# EAGLE design BEP32 (EAGLE 6.5.0)
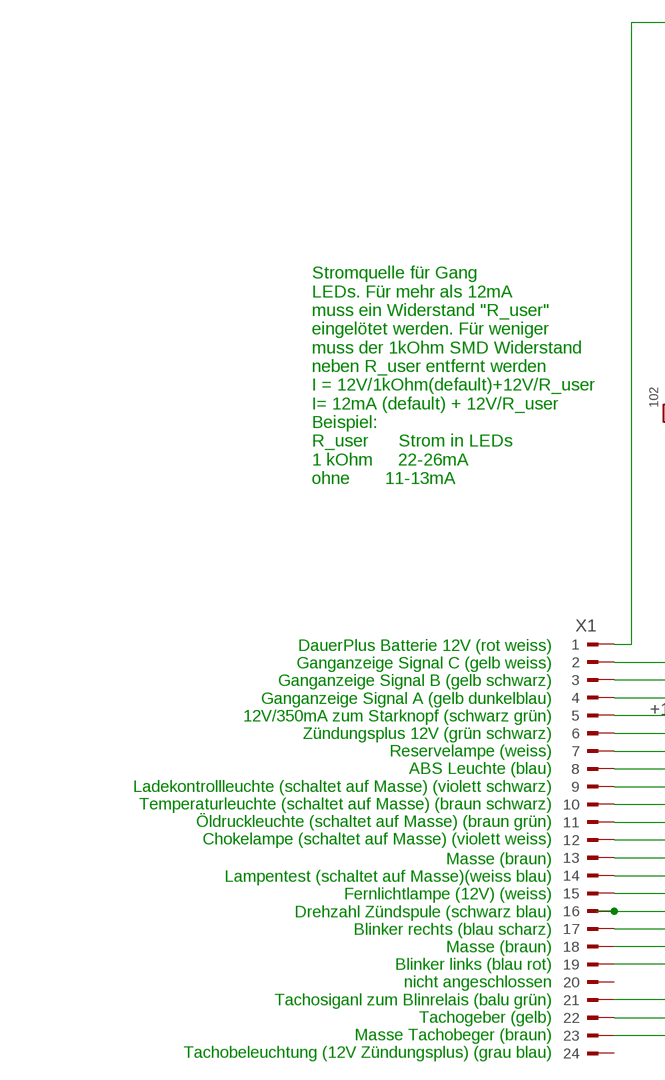
[diagram p0: schematic, sheet 1, part 1 of 2]
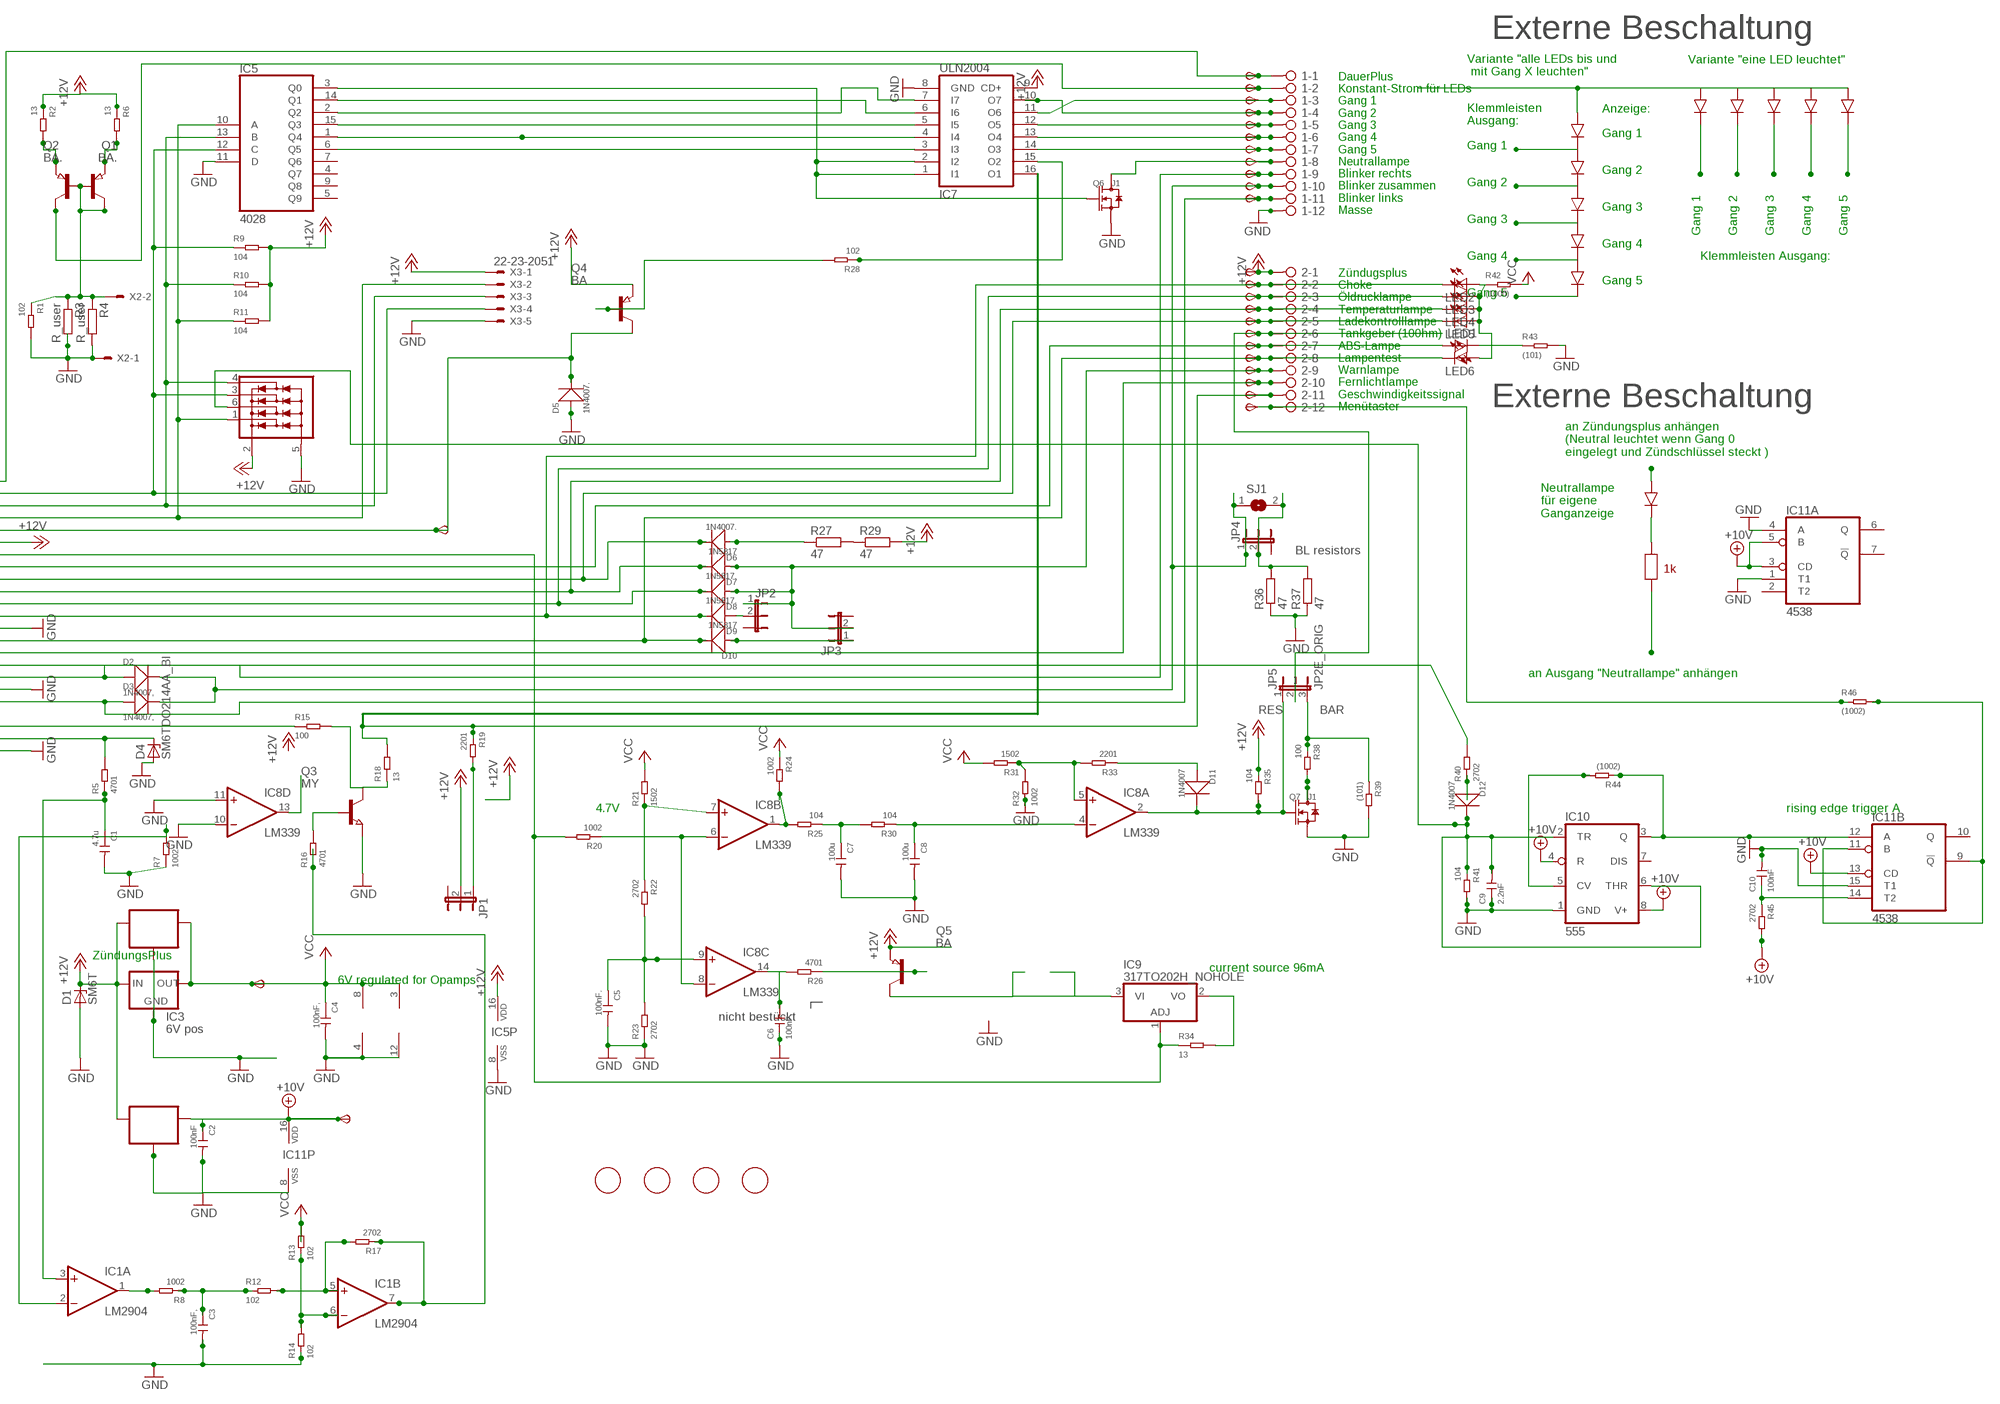
[diagram p1: schematic, sheet 1, part 2 of 2]

## Parts
1  2081-1132  [12-PIN]
2  2081-1132  [12-PIN]
6V  TPSB2.0  [B2.0]
10V  TPSB2.0  [B2.0]
C1  4.7u  CERAMIC-4.7UF-25V-10%-X5R(0805)  [C0805]
C2  100nF  CERAMIC-100NF-50V-10%-X7R(0805)  [C0805]
C3  100nF,  CERAMIC-100NF-50V-10%-X7R(0805)  [C0805]
C4  100nF,  CERAMIC-100NF-50V-10%-X7R(0805)  [C0805]
C5  100nF.  CERAMIC-100NF-50V-10%-X7R(0805)  [C0805]
C6  100nF.  CERAMIC-100NF-50V-10%-X7R(0805)  [C0805]
C7  100u  CERAMIC-100UF-6.3V-20%-X5R(1206)  [C1206]
C8  100u  CERAMIC-100UF-6.3V-20%-X5R(1206)  [C1206]
C9  2.2nF  CERAMIC-100NF-50V-10%-X7R(0805)  [C0805]
C10  100nF  CERAMIC-100NF-50V-10%-X7R(0805)  [C0805]
D1  SM6T  [DO214AA]
D2  1N4007,  DIODE-GEN-PURPOSE-1KV-1A(DO-214AC)  [DO-214AC]
D3  1N4007,  DIODE-GEN-PURPOSE-1KV-1A(DO-214AC)  [DO-214AC]
D4  SM6TDO214AA_BI  [DO214AA_BI]
D5  1N4007.  DIODE-GEN-PURPOSE-1KV-1A(DO-214AC)  [DO-214AC]
D6  1N4007.  DIODE-GEN-PURPOSE-1KV-1A(DO-214AC)  [DO-214AC]
D7  1N5817  DIODE-GEN-PURPOSE-1KV-1A(DO-214AC)DO-214AC/1206  [DO-214AC_SLIM]
D8  1N5817.  DIODE-GEN-PURPOSE-1KV-1A(DO-214AC)DO-214AC/1206  [DO-214AC_SLIM]
D9  1N5817.  DIODE-GEN-PURPOSE-1KV-1A(DO-214AC)DO-214AC/1206  [DO-214AC_SLIM]
D10  1N5817  DIODE-GEN-PURPOSE-1KV-1A(DO-214AC)DO-214AC/1206  [DO-214AC_SLIM]
D11  1N4007  DIODE-GEN-PURPOSE-1KV-1A(DO-214AC)  [DO-214AC]
D12  1N4007  DIODE-GEN-PURPOSE-1KV-1A(DO-214AC)  [DO-214AC]
FID1  FIDUCIAL  [FIDUCIAL_1MM]
FID2  FIDUCIAL  [FIDUCIAL_1MM]
FID3  FIDUCIAL  [FIDUCIAL_1MM]
FID4  FIDUCIAL  [FIDUCIAL_1MM]
IC1  LM2904  LM358D  [SO08]
IC2  78L06  78LXXSOT89_ROUND  [SOT89_ROUND]
IC3  6V pos  78LXX  [78LXX]
IC4  78L10  78LXXSOT89_ROUND  [SOT89_ROUND]
IC5  4028  4028D  [SO16]
IC6  NUP4304SOT457_R  [SOT457R_PHILIPS]
IC7  ULN2004  ULN2004AD  [SO16]
IC8  LM339  LM339D  [SO14]
IC9  317TO202H_NOHOLE  [TO220H_NOHOLE]
IC10  555  NE555D  [SO08]
IC11  4538  4538D  [SO16]
JP1  JP2EJP2_SMALLPADS  [JP2_SMALLPADS]
JP2  JP2EJP2_SMALLPADS  [JP2_SMALLPADS]
JP3  JP2EJP2_SMALLPADS  [JP2_SMALLPADS]
JP4  JP2EJP2_SMALLPADS  [JP2_SMALLPADS]
JP5  JP2E_ORIG  [JP2_ORIG_SMALLPADS]
LED1  LEDLD260  [LD260]
LED2  LEDLD260  [LD260]
LED3  LEDLD260  [LD260]
LED4  LEDLD260  [LD260]
LED5  LEDLD260  [LD260]
LED6  LEDLD260  [LD260]
Q1  BA.  PNP-TRANSISTOR_SOT89  [SOT89]
Q2  BA.  PNP-TRANSISTOR_SOT89  [SOT89]
Q3  MY  NPN-TRANSISTOR_SOT89  [SOT89]
Q4  BA  PNP-TRANSISTOR_SOT89  [SOT89]
Q5  BA  PNP-TRANSISTOR_SOT89  [SOT89]
Q6  J1  SMD-MOSFET-N-CH-50V-200MA-BSS138W-7-F(SOT-23)  [SOT-23]
Q7  J1  SMD-MOSFET-N-CH-50V-200MA-BSS138W-7-F(SOT-23)  [SOT-23]
R1  102  SMD-RES-1K-5%-1/8W(0805)  [R0805]
R2  13  SMD-RES-13R-5%-1/4W(1206)  [R1206]
R3  R_user  R-EU_R0805  [R0805]
R4  R_user  R-EU_R0805  [R0805]
R5  4701  SMD-RES-4.7K-5%-1/8W(0805)  [R0805]
R6  13  SMD-RES-13R-5%-1/4W(1206)  [R1206]
R7  1002  SMD-RES-10K-1%-1/8W(0805)  [R0805]
R8  1002  SMD-RES-10K-1%-1/8W(0805)  [R0805]
R9  104  SMD-RES-10K-1%-1/8W(0805)  [R0805]
R10  104  SMD-RES-10K-1%-1/8W(0805)  [R0805]
R11  104  SMD-RES-10K-1%-1/8W(0805)  [R0805]
R12  102  SMD-RES-1K-5%-1/8W(0805)  [R0805]
R13  102  SMD-RES-1K-5%-1/8W(0805)  [R0805]
R14  102  SMD-RES-1K-5%-1/8W(0805)  [R0805]
R15  100  SMD-RES-220R-5%-1/8W(0805)  [R0805]
R16  4701  SMD-RES-4.7K-5%-1/8W(0805)  [R0805]
R17  2702  SMD-RES-4.7K-5%-1/8W(0805)  [R0805]
R18  13  SMD-RES-13R-5%-1/4W(1206)  [R1206]
R19  2201  SMD-RES-2.2K-5%-1/8W(0805)  [R0805]
R20  1002  SMD-RES-10K-1%-1/8W(0805)  [R0805]
R21  1502  SMD-RES-10K-1%-1/8W(0805)  [R0805]
R22  2702  SMD-RES-4.7K-5%-1/8W(0805)  [R0805]
R23  2702  SMD-RES-4.7K-5%-1/8W(0805)  [R0805]
R24  1002  SMD-RES-10K-1%-1/8W(0805)  [R0805]
R25  104  SMD-RES-10K-1%-1/8W(0805)  [R0805]
R26  4701  SMD-RES-4.7K-5%-1/8W(0805)  [R0805]
R27  47  R-EU_V235/17_1MM  [V235/17_1MM]
R28  102  SMD-RES-1K-5%-1/8W(0805)  [R0805]
R29  47  R-EU_V235/17_1MM  [V235/17_1MM]
R30  104  SMD-RES-10K-1%-1/8W(0805)  [R0805]
R31  1502  SMD-RES-10K-1%-1/8W(0805)  [R0805]
R32  1002  SMD-RES-10K-1%-1/8W(0805)  [R0805]
R33  2201  SMD-RES-2.2K-5%-1/8W(0805)  [R0805]
R34  13  SMD-RES-13R-5%-1/4W(1206)  [R1206]
R35  104  SMD-RES-10K-1%-1/8W(0805)  [R0805]
R36  47  R-EU_V235/17_1MM  [V235/17_1MM]
R37  47  R-EU_V235/17_1MM  [V235/17_1MM]
R38  100  SMD-RES-2.2K-5%-1/8W(0805)  [R0805]
R39  (101)  SMD-RES-2.2K-5%-1/8W(0805)  [R0805]
R40  2702  SMD-RES-10K-1%-1/8W(0805)  [R0805]
R41  104  SMD-RES-10K-1%-1/8W(0805)  [R0805]
R42  (1000)  SMD-RES-100R-5%-1/8W(0805)  [R0805]
R43  (101)  SMD-RES-100R-5%-1/8W(0805)  [R0805]
R44  (1002)  SMD-RES-10K-1%-1/8W(0805)  [R0805]
R45  2702  SMD-RES-4.7K-5%-1/8W(0805)  [R0805]
R46  (1002)  SMD-RES-4.7K-5%-1/8W(0805)  [R0805]
SJ1  SJ  [SJ]
START  TPSB2.0  [B2.0]
TP1  TPSB2.0  [B2.0]
TP2  TPSB2.0  [B2.0]
TP3  TPSB2.0  [B2.0]
TP4  TPSB2.0  [B2.0]
TP5  TPSB2.0  [B2.0]
TP6  TPSB2.0  [B2.0]
TP7  TPSB2.0  [B2.0]
TP8  TPSB2.0  [B2.0]
TP9  TPSB2.0  [B2.0]
TP10  TPSB2.0  [B2.0]
TP11  TPSB2.0  [B2.0]
TP12  TPSB2.0  [B2.0]
TP13  TPSB2.0  [B2.0]
TP16  TPSB2.0  [B2.0]
TP17  TPSB2.0  [B2.0]
TP18  TPSB2.0  [B2.0]
TP19  TPSB2.0  [B2.0]
TP21  TPSB2.0  [B2.0]
TP22  TPSB2.0  [B2.0]
TP23  TPSB2.0  [B2.0]
TP24  TPSB1,27  [B1,27]
TP25  TPSB2.0  [B2.0]
TP26  TPSB2.0  [B2.0]
X1  CON_BMWV2  [24-PIN_V2]
X2  22-23-2021  [22-23-2021]
X3  22-23-2051  [22-23-2051]

## Nets
+10V: 10V.TP(PP) C2.1 IC4.1(OUT) IC10.4(R) IC10.8(V+) IC11.3(A:CD) IC11.5(A:B) IC11.13(B:CD) IC11.16(P:VDD) R45.2
+12V: 2.1 D1.C IC2.3(IN) IC3.IN IC4.3(IN) IC5.16(VDD) IC6.2(V+) IC7.9(CD+) JP1.2 Q4.3(E) Q5.3(E) R2.1 R6.1 R9.2 R10.2 R11.2 R29.2 R35.1 TP12.TP(PP) X1.6 X3.1
+12V1: IC1.7(B:OUT) R16.1 R17.1
GND: 1.12 C1.2 C2.2 C3.2 C4.2 C5.2 C6.1 C7.2 C8.2 C9.1 C10.2 D1.A D4.A D5.1(+) IC1.4(P:V-) IC2.2(GND) IC2.2@1(GND) IC3.GND IC4.2(GND) IC4.2@1(GND) IC5.8(VSS) IC5.11(D) IC6.5(V-) IC7.8(GND) IC8.10(D:-IN) IC8.11(D:+IN) IC8.12(P:GND) IC10.1(GND) IC11.1(A:T1) IC11.4(A:A) IC11.8(P:VSS) IC11.15(B:T1) Q3.3(E) Q6.2(S) Q7.2(S) R1.2 R3.2 R4.2 R7.1 R14.1 R23.1 R32.1 R36.1 R37.1 R39.2 R41.2 R43.2 X1.13 X1.18 X1.23 X2.1 X3.5
N$1: 2.9 D7.1(+) D8.1(+) JP2.1 JP3.2 TP24.TP(PP)
N$2: IC5.10(A) IC6.1(D1) R11.1 X1.4 X3.2
N$3: IC5.13(B) IC6.4(D4) R10.1 X1.3 X3.3
N$4: 2.7 LED1.A TP22.TP(PP) X1.8
N$5: Q1.3(E) R2.2
N$6: D11.2(-) IC8.2(A:OUT) JP5.1 Q7.1(G) R35.2
N$7: IC1.2(A:-IN) R7.2
N$8: R27.2 R29.1
N$9: Q2.3(E) R6.2
N$11: D5.2(-) Q4.2(C) START.TP(PP) X1.5
N$12: 2.2 D9.2(-) LED2.K(C) TP16.TP(PP) X1.12
N$13: 2.3 D8.2(-) LED3.K(C) TP17.TP(PP) X1.11
N$14: 2.4 D7.2(-) LED4.K(C) TP18.TP(PP) X1.10
N$15: IC9.3(VI) Q5.2(C)
N$16: IC8.6(B:-IN) IC8.8(C:-IN) R20.1
N$17: IC5.12(C) IC6.3(D3) R9.1 X1.2 X3.4
N$18: IC5.15(Q3) IC7.5(I5)
N$19: 2.8 D10.2(-) LED6.K(C) TP23.TP(PP) X1.14
N$20: 1.9 D2.1(+) TP9.TP(PP) X1.17
N$21: 1.11 D3.1(+) TP11.TP(PP) X1.19
N$22: IC11.9(B:!Q) IC11.11(B:B) R46.2
N$23: D4.C R5.2 X1.22
N$24: C1.1 IC1.3(A:+IN) R5.1
N$25: 1.6 IC7.13(O4) TP6.TP(PP)
N$26: 1.7 IC7.14(O3) TP7.TP(PP)
N$27: 2.11 IC7.16(O1) R18.2 R19.1 TP26.TP(PP)
N$28: 2.6 JP5.2 TP21.TP(PP)
N$29: JP1.1 R19.2
N$30: C5.1 IC8.9(C:+IN) R22.2 R23.2
N$31: C6.2 IC8.14(C:OUT) R26.2
N$32: C9.2 D12.2(-) IC6.6(D2) IC10.2(TR) IC10.6(THR) R41.1
N$34: LED1.K(C) R43.1
N$35: IC9.1(ADJ) R20.2 R34.1 X1.7
N$36: Q5.1(B) R26.1
N$37: IC5.2(Q2) IC7.7(I7)
N$38: 1.3 IC7.11(O6) TP3.TP(PP)
N$39: 1.5 IC7.12(O5) TP5.TP(PP)
N$41: LED2.A LED3.A LED4.A LED5.A LED6.A R42.1
N$42: R40.2 X1.16
N$43: Q4.1(B) R28.2
N$44: IC5.3(Q0) IC7.1(I1) IC7.2(I2) Q6.1(G)
N$45: C7.1 R25.1 R30.2
N$46: C8.1 IC8.4(A:-IN) R30.1
N$47: IC8.5(A:+IN) R31.1 R32.2 R33.2
N$48: Q7.3(D) R38.2
N$49: D11.1(+) R33.1
N$50: IC5.1(Q4) IC7.4(I4)
N$51: R15.1 X1.21
N$52: 1.8 Q6.3(D) TP8.TP(PP)
N$53: 2.10 TP25.TP(PP) X1.15
N$54: D6.1(+) R27.1
N$55: 2.5 D6.2(-) LED5.K(C) TP19.TP(PP) X1.9
N$56: IC5.14(Q1) IC7.6(I6)
N$57: Q1.1(B) Q2.1(B) Q2.2(C) R1.1 R3.1 R4.1 X2.2
N$58: Q3.2(C) R15.2 R18.1
N$59: 1.2 Q1.2(C) TP2.TP(PP)
N$60: IC8.13(D:OUT)
N$61: IC5.6(Q5) IC7.3(I3)
N$64: IC9.2(VO) R34.2
N$65: IC10.5(CV) R44.2
N$67: 1.4 IC7.10(O7) TP4.TP(PP)
N$69: 1.1 TP1.TP(PP) X1.1
N$83: IC8.7(B:+IN) R21.1 R22.1
N$85: Q3.1(B) R16.2
N$86: IC10.3(Q) IC11.12(B:A) R44.1
N$87: D12.1(+) R40.1
N$88: IC7.15(O2) R28.1
N$89: C10.1 IC11.14(B:T2) R45.1
N$90: 2.12 R46.1 TP13.TP(PP)
N$92: IC1.1(A:OUT) R8.2
N$93: 1.10 D2.2(-) D3.2(-) JP4.1 SJ1.1 TP10.TP(PP)
N$94: JP4.2 R36.2 R37.2 SJ1.2
N$95: D9.1(+) JP2.2
N$96: C3.1 R8.1 R12.1
N$97: IC1.5(B:+IN) R12.2 R17.2
N$98: D10.1(+) JP3.1
N$99: JP5.3 R38.1 R39.1
N$101: IC1.6(B:-IN) R13.1 R14.2
N$580: IC8.1(B:OUT) R24.2 R25.2
VCC: 6V.TP(PP) C4.1 IC1.8(P:V+) IC2.1(OUT) IC3.OUT IC8.3(P:V+) R13.2 R21.2 R24.1 R31.2 R42.2
Unconnected: IC5.4(Q7) IC5.5(Q9) IC5.7(Q6) IC5.9(Q8) IC10.7(DIS) IC11.2(A:T2) IC11.6(A:Q) IC11.7(A:!Q) IC11.10(B:Q) X1.20 X1.24

## Notes on the sheet
- Externe Beschaltung
- Variante "eine LED leuchtet"
- Variante "alle LEDs bis und
   mit Gang X leuchten"
- Anzeige:
- Klemmleisten
  Ausgang:
- Gang 1
- DauerPlus
  Konstant-Strom für LEDs
  Gang 1
  Gang 2
  Gang 3
  Gang 4
  Gang 5
  Neutrallampe
  Blinker rechts
  Blinker zusammen
  Blinker links
  Masse
- Gang 1
- Gang 2
- Gang 2
- Gang 3
- Gang 3
- Gang 1 | Gang 2 | Gang 3 | Gang 4 | Gang 5
- Gang 4
- Gang 4 | Klemmleisten Ausgang:
- Gang 5
- Gang 5
- Zündugsplus
  Choke
  Öldrucklampe
  Temperaturlampe
  Ladekontrolllampe
  Tankgeber (100hm)
  ABS-Lampe
  Lampentest
  Warnlampe
  Fernlichtlampe
  Geschwindigkeitssignal
  Menütaster
- Stromquelle für Gang
  LEDs. Für mehr als 12mA
  muss ein Widerstand "R_user"
  eingelötet werden. Für weniger
  muss der 1kOhm SMD Widerstand
  neben R_user entfernt werden
  I = 12V/1kOhm(default)+12V/R_user
  I= 12mA (default) + 12V/R_user
  Beispiel:
  R_user      Strom in LEDs
  1 kOhm     22-26mA
  ohne       11-13mA
- Externe Beschaltung
- an Zündungsplus anhängen
  (Neutral leuchtet wenn Gang 0
  eingelegt und Zündschlüssel steckt )
- Neutrallampe
  für eigene
  Ganganzeige
- DauerPlus Batterie 12V (rot weiss)
  Ganganzeige Signal C (gelb weiss)
  Ganganzeige Signal B (gelb schwarz)
  Ganganzeige Signal A (gelb dunkelblau)
  12V/350mA zum Starknopf (schwarz grün)
  Zündungsplus 12V (grün schwarz)
  Reservelampe (weiss)
  ABS Leuchte (blau)
  Ladekontrollleuchte (schaltet auf Masse) (violett schwarz)
  Temperaturleuchte (schaltet auf Masse) (braun schwarz)
  Öldruckleuchte (schaltet auf Masse) (braun grün)
  Chokelampe (schaltet auf Masse) (violett weiss)
- BL resistors
- 1k
- an Ausgang "Neutrallampe" anhängen
- Masse (braun)
  Lampentest (schaltet auf Masse)(weiss blau)
  Fernlichtlampe (12V) (weiss)
  Drehzahl Zündspule (schwarz blau)
  Blinker rechts (blau scharz)
  Masse (braun)
  Blinker links (blau rot)
  nicht angeschlossen
  Tachosiganl zum Blinrelais (balu grün)
  Tachogeber (gelb)
  Masse Tachobeger (braun)
  Tachobeleuchtung (12V Zündungsplus) (grau blau)
- RES | BAR
- 4.7V | rising edge trigger A
- ZündungsPlus
- current source 96mA
- 6V regulated for Opamps
- nicht bestückt

## Library data of the parts
1 2 = con WAGO BMW:2081-1132: WAGO SREW CLAMP
6V 10V START TP1-TP13 TP16-TP19 TP21-TP26 = testpin_BMW:TPS: TEST PIN
C1 = Seeed-Capacitor-2016:CERAMIC-4.7UF-25V-10%-X5R(0805): 302010146; MPN: CC0805KKX5R8BB475; VALUE: 4.7uf
C2-C6 C9 C10 = Seeed-Capacitor-2016:CERAMIC-100NF-50V-10%-X7R(0805): 302010165; MPN: CC0805KRX7R9BB104; VALUE: 100nf
C7 C8 = Seeed-Capacitor-2016:CERAMIC-100UF-6.3V-20%-X5R(1206): 302010183; MPN: GRM31CR60J107ME39L; VALUE: 100uf
D1 D4 = Suppressor_Diode_DO214AA:SM6T: Z DIODE
D2 D3 D5 D6 = Diode-do214ac:DIODE-GEN-PURPOSE-1KV-1A(DO-214AC): 304010013; MPN: 1N4007; VALUE: 1N4007
D7-D10 = Diode-do214ac:DIODE-GEN-PURPOSE-1KV-1A(DO-214AC): 304010013
D11 D12 = Diode-do214ac:DIODE-GEN-PURPOSE-1KV-1A(DO-214AC): 304010013; MPN: 1N4007
FID1-FID4 = Fiducial:FIDUCIAL: For use by pick and place machines to calibrate the vision/machine, 1mm By microbuilder.eu
IC1 = linear_BMW:LM358: OP AMP also LM158; LM258; LM2904 Source: http://cache.national.com/ds/LM/LM158.pdf
IC2 IC4 = 78LXX:78LXX
IC3 = v-reg:78LXX: VOLTAGE REGULATOR
IC5 = 4028:4028: BCD to decimal DECODER
IC6 = NUP4304_ESD_Diode_Array:NUP4304
IC7 = uln-udn:ULN2004A: DRIVER ARRAY
IC8 = LM339:LM339: Low Power Low Offset Voltage Quad Comparators with open collector; LM139/LM239/LM339/LM2901/LM3302
IC9 = linear_BMW:*317: Positive VOLTAGE REGULATOR
IC10 = linear:*555: TIMER
IC11 = 45xx:4538: Dual precision monostable MULTIVIBRATOR
JP1-JP4 = Switch Aliexpress 2:JP2E: JUMPER
JP5 = Switch Aliexpress 2:JP2E_ORIG
LED1-LED6 = led:LED: LED OSRAM: - CHIPLED LG R971, LG N971, LY N971, LG Q971, LY Q971, LO R971, LY R971 LH N974, LH R974 LS Q976, LO Q976, LY Q976 LO Q996 - Hyper CHIPLED LW Q18S LB Q993, LB Q99A, LB R99A - SideLED LS A670, LO A670, LY A670, LG A670, LP A670 LB A673, LV A673, LT A673, LW A673 LH A674 LY A675 LS A676, LA A676, LO A676, LY A676, LW A676 LS A679, LY A679, LG A679 - Hyper Micro SIDELED® LS Y876, LA Y876, LO Y876, LY Y876 LT Y87S - SmartLED LW L88C, LW L88S LB L89C, LB L89S, LG L890 LS L89K, LO L89K, LY L89K LS L896, LA L896, LO L896, LY L896 - TOPLED LS T670, LO T670, LY T670, LG T670, LP T670 LSG T670, LSP T670, LSY T670, LOP T670, LYG T670 LG T671, LOG T671, LSG T671 LB T673, LV T673, LT T673, LW T673 LH T674 LS T676, LA T676, LO T676, LY T676, LB T676, LH T676, LSB T676, LW T676 LB T67C, LV T67C, LT T67C, LS T67K, LO T67K, LY T67K, LW E67C LS E67B, LA E67B, LO E67B, LY E67B, LB E67C, LV E67C, LT E67C LW T67C LS T679, LY T679, LG T679 LS T770, LO T770, LY T770, LG T770, LP T770 LB T773, LV T773, LT T773, LW T773 LH T774 LS E675, LA E675, LY E675, LS T675 LS T776, LA T776, LO T776, LY T776, LB T776 LHGB T686 LT T68C, LB T68C - Hyper Mini TOPLED® LB M676 - Mini TOPLED Santana® LG M470 LS M47K, LO M47K, LY M47K Source: http://www.osram.convergy.de LUXEON: - LUMILED® LXK2-PW12-R00, LXK2-PW12-S00, LXK2-PW14-U00, LXK2-PW14-V00 LXK2-PM12-R00, LXK2-PM12-S00, LXK2-PM14-U00 LXK2-PE12-Q00, LXK2-PE12-R00, LXK2-PE12-S00, LXK2-PE14-T00, LXK2-PE14-U00 LXK2-PB12-K00, LXK2-PB12-L00, LXK2-PB12-M00, LXK2-PB14-N00, LXK2-PB14-P00, LXK2-PB14-Q00 LXK2-PR12-L00, LXK2-PR12-M00, LXK2-PR14-Q00, LXK2-PR14-R00 LXK2-PD12-Q00, LXK2-PD12-R00, LXK2-PD12-S00 LXK2-PH12-R00, LXK2-PH12-S00 LXK2-PL12-P00, LXK2-PL12-Q00, LXK2-PL12-R00 Source: www.luxeon.com KINGBRIGHT: KA-3528ASYC Source: www.kingbright.com
Q1 Q2 Q4 Q5 = Transistor_SOT89:PNP-TRANSISTOR_: PNP TRANSISTOR
Q3 = Transistor_SOT89:NPN-TRANSISTOR_: NPN TRANSISTOR
Q6 Q7 = Seeed-Transistor-2016:SMD-MOSFET-N-CH-50V-200MA-BSS138W-7-F(SOT-23): 305030000; MPN: BSS138W-7-F; VALUE: BSS138W-7-F
R1 R12-R14 R28 = Seeed-Resistor-2016:SMD-RES-1K-5%-1/8W(0805): 301010311; MPN: RC0805JR-071KL; VALUE: 1K
R2 R6 R18 R34 = Seeed-Resistor-2016:SMD-RES-13R-5%-1/4W(1206): 301010405; MPN: RC1206JR-0713RL; VALUE: 13R
R3 R4 R27 R29 R36 R37 = rcl:R-EU_: RESISTOR, European symbol
R5 R16 R17 R22 R23 R26 R45 R46 = Seeed-Resistor-2016:SMD-RES-4.7K-5%-1/8W(0805): 301010306; MPN: RC0805JR-074K7L; VALUE: 4.7K
R7-R11 R20 R21 R24 R25 R30-R32 R35 R40 R41 R44 = Seeed-Resistor-2016:SMD-RES-10K-1%-1/8W(0805): 301010361; MPN: RC0805FR-0710KL; VALUE: 10K
R15 = Seeed-Resistor-2016:SMD-RES-220R-5%-1/8W(0805): 301010315; MPN: RC0805JR-07220RL; VALUE: 220R
R19 R33 R38 R39 = Seeed-Resistor-2016:SMD-RES-2.2K-5%-1/8W(0805): 301010333; MPN: RC0805JR-072K2L; VALUE: 2.2K
R42 R43 = Seeed-Resistor-2016:SMD-RES-100R-5%-1/8W(0805): 301010319; MPN: RC0805JR-07100RL; VALUE: 100R
SJ1 = solder-jumper:SJ: SMD solder JUMPER
X1 = con_BMW:CON_BMW: BMW CONNECTOR
X2 = con_Molex_BMW:22-23-2021: .100" (2.54mm) Center Header - 2 Pin; MF: MOLEX; MPN: 22-23-2021; OC_FARNELL: 1462926; OC_NEWARK: 25C3832
X3 = con_Molex_BMW:22-23-2051: .100" (2.54mm) Center Header - 5 Pin; MF: MOLEX; MPN: 22-23-2051; OC_FARNELL: 1462952; OC_NEWARK: 38C9178

## Board
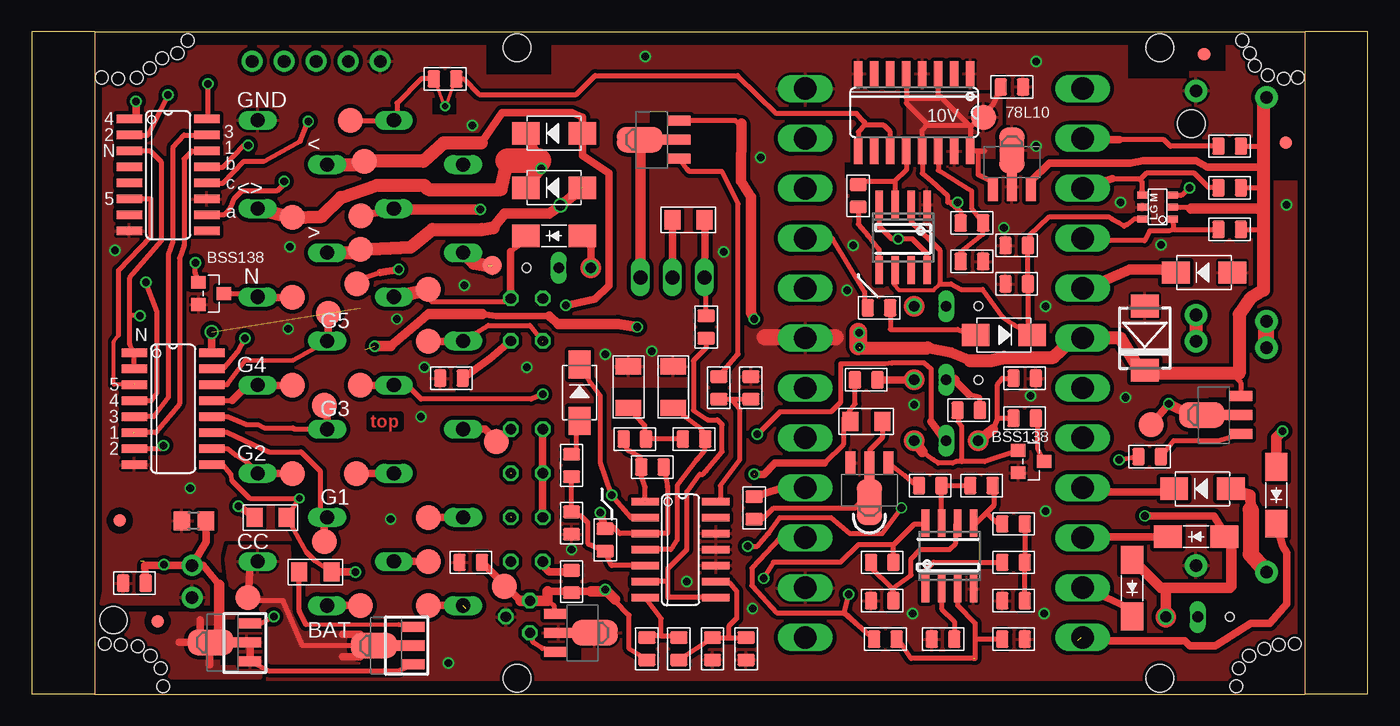
[diagram p2: board, top side]
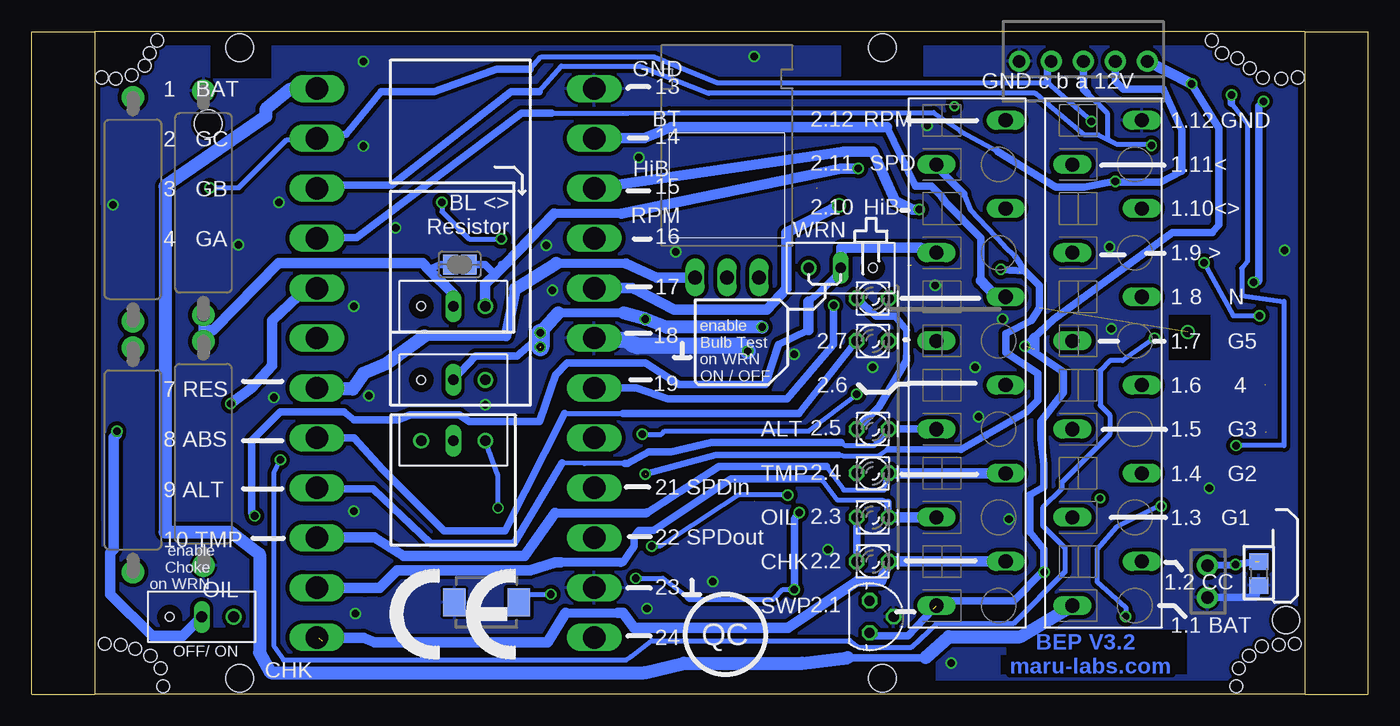
[diagram p3: board, bottom side, seen from below]

Size 106 x 52.6 mm. Coordinates in mm from the lower left corner, seen from the top.
Outline: 101,52.6 101,0
Outline: 5,0 101,0
Outline: 5,52.6 101,52.6
Outline: 5,52.6 5,0
Outline: 5,52.6 0,52.6 0,0 5,0
Outline: 101,0 106,0 106,52.6 101,52.6
Copper layers (1*16): Top 0.035mm / dielectric 1.5mm / Bottom 0.035mm
Design rules "multi-cb_035um-cu *": minimum track width 6mil, minimum drill 12mil, track to track 12mil, track to pad 12mil, pad to pad 6mil, via to via 6mil, smd to smd 6mil, copper to edge 10mil, drill to drill 8mil, minimum pad ring 8mil, minimum via ring 6mil, stop-mask expansion 3mil, vias tented up to drill 0mil, thermal gap 8mil
Holes 1.02 mm at 5.81,4.01 7.08,3.94 8.43,3.83 9.43,3.05 10.24,2.07 100.45,48.96 99.31,48.87 98.04,49.13 97.03,49.89 100.19,4.01 98.92,3.94 97.77,3.63 96.57,3.05 95.76,2.07 5.55,48.96 6.89,48.87 8.36,48.93 9.37,49.69 96.63,50.89 96.03,51.89 10.37,50.49 11.57,50.89 12.37,51.89 10.44,0.67 95.56,0.67
Holes 2.18 mm at 6.5,5.9 92,45.3
Holes 2.2 mm at 89.5,1.3 38.5,1.3 38.5,51.3 89.5,51.3
tRestrict: area 46,21 to 52.5,24.3; area 31.8,46 to 33.7,47.3; area 63.4,16.6 to 65.2,18.6; area 49.1,41.9 to 50.5,46.2; area 42.3,2.7 to 43.6,7.2; area 43.6,5.9 to 46.3,7.1; area 15,2.4 to 16.4,5.9; area 75.3,41.2 to 80,42.5; area 93.4,22.4 to 95,23.6; area 86.1,38 to 87.2,38.2; area 98.5,40.8 to 100.4,43; area 91.4,49.5 to 94.7,52.2; 3 more areas
bRestrict: area 14.4,1.6 to 24.6,5.1; area 24.5,1.6 to 29.1,3.1; area 34.3,0.9 to 40.8,3.1; area 35.3,49.1 to 41.8,51.5; area 86.6,1.5 to 92.6,5.3; area 12.5,26.5 to 15.8,30.1; area 87,48.9 to 91.8,51.9

### Footprints (pad centres in the part's own frame; a part is rotated, then mirrored left to right if it is on the bottom)
12-PIN = drill 1.118 long: 1 19.25,-2.45; 2 15.75,3.05; 3 12.25,-2.45; 4 8.75,3.05; 5 5.25,-2.45; 6 1.75,3.05; 7 -1.75,-2.45; 8 -5.25,3.05; 9 -8.75,-2.45; 10 -12.25,3.05; 11 -15.75,-2.45; 12 -19.25,3.05
B2.0 = smd 2 x 2: TP 0,0
C0805 = smd 1.397 x 1.016: 1 0,0.889; 2 0,-0.889
C1206 = smd 1.27 x 2.032: 1 -1.651,0; 2 1.651,0
DO214AA = smd 1.8 x 2.2: A 2.55,0; C -2.55,0
DO-214AC = smd 2.2 x 1.77: 1 -2.242,0; 2 2.242,0
DO214AA_BI = smd 1.8 x 2.2: A 2.45,0; C -2.65,0
DO-214AC_SLIM = smd 2.2 x 1.77: 1 -2.242,0; 2 2.242,0
FIDUCIAL_1MM = smd 1 x 1: 1 0,0
SO08 = smd 0.6 x 2.2: 1 -1.905,-2.6; 2 -0.635,-2.6; 3 0.635,-2.6; 4 1.905,-2.6; 5 1.905,2.6; 6 0.635,2.6; 7 -0.635,2.6; 8 -1.905,2.6
SOT89_ROUND = smd 0.8 x 1.8: 1 -1.499,-2.181; 3 1.499,-2.181 | smd 0.8 x 2.3: 2 0,-1.927 | smd 2.032 x 3.65: 2@1 0,0.94
78LXX = drill 0.813 octagon: GND 0,1.905; IN 1.27,0; OUT -1.27,0
SO16 = smd 0.66 x 2.032: 1 -4.445,-3.073; 2 -3.175,-3.073; 3 -1.905,-3.073; 4 -0.635,-3.073; 5 0.635,-3.073; 6 1.905,-3.073; 7 3.175,-3.073; 8 4.445,-3.073; 9 4.445,3.073; 10 3.175,3.073; 11 1.905,3.073; 12 0.635,3.073; 13 -0.635,3.073; 14 -1.905,3.073; 15 -3.175,3.073; 16 -4.445,3.073
SOT457R_PHILIPS = smd 0.55 x 0.8: 1 -0.95,-1.2; 2 0,-1.2; 3 0.95,-1.2; 4 0.95,1.2; 5 0,1.2; 6 -0.95,1.2
SO14 = smd 0.6 x 2.2: 1 -3.81,-2.8; 2 -2.54,-2.8; 3 -1.27,-2.8; 4 0,-2.8; 5 1.27,-2.8; 6 2.54,-2.8; 7 3.81,-2.8; 8 3.81,2.8; 9 2.54,2.8; 10 1.27,2.8; 11 0,2.8; 12 -1.27,2.8; 13 -2.54,2.8; 14 -3.81,2.8
TO220H_NOHOLE = drill 1.118 long: 1 -2.54,-10.16; 2 0,-10.16; 3 2.54,-10.16
JP2_SMALLPADS = drill 0.85: 1 -2.54,0 | drill 0.85 long: 2 0,0 | hole 0.7: 2.54,0
JP2_ORIG_SMALLPADS = drill 0.85: 1 -2.54,0; 3 2.54,0 | drill 0.85 long: 2 0,0
LD260 = drill 0.813 octagon: A -1.27,0; K 1.27,0
SOT89 = smd 0.8 x 1.8: 1 -1.499,-2.181; 3 1.499,-2.181 | smd 0.8 x 2.3: 2 0,-1.927 | smd 2.032 x 3.65: 2@1 0,0.94
SOT-23 = smd 1.016 x 1.143: 1 -0.889,-1.016; 2 0.889,-1.016; 3 0,1.016
R0805 = smd 1.397 x 1.016: 1 0,0.889; 2 0,-0.889
R1206 = smd 1.27 x 1.524: 1 -1.27,0; 2 1.27,0
R0805' = smd 1.3 x 1.5: 1 -0.95,0; 2 0.95,0
V235/17_1MM = drill 1 pad 1.778: 1 -8.89,0; 2 8.89,0
SJ = smd 1.2 x 1.6: 1 -0.725,0; 2 0.725,0
B1,27 = smd 1.5 x 1.5: TP 0,0
24-PIN_V2 = drill 1.778 long: 1 -21.78,-11; 2 -17.82,-11; 3 -13.86,-11; 4 -9.9,-11; 5 -5.94,-11; 6 -1.98,-11; 7 1.98,-11; 8 5.94,-11; 9 9.9,-11; 10 13.86,-11; 11 17.82,-11; 12 21.78,-11; 13 -21.78,11; 14 -17.82,11; 15 -13.86,11; 16 -9.9,11; 17 -5.94,11; 18 -1.98,11; 19 1.98,11; 20 5.94,11; 21 9.9,11; 22 13.86,11; 23 17.82,11; 24 21.78,11
22-23-2021 = drill 1 pad 1.676: 1 -1.27,0; 2 1.27,0
22-23-2051 = drill 1 pad 1.676: 1 -5.08,0; 2 -2.54,0; 3 0,0; 4 2.54,0; 5 5.08,0

### Placement (x,y rotation side)
1  20.99,26.3 270 bottom
2  31.79,26.3 270 bottom
6V  37.5,8.58 0 top
10V  75.5,45.8 0 top
C1  77.89,4.39 90 top
C2  77.76,48.2 90 top
C3  77.89,7.44 270 top
C4  34.83,10.48 270 top
C5  54.01,3.63 0 top
C6  57.06,24.33 0 top
C7  47.34,24.39 90 top
C8  50.9,24.39 90 top
C9  78.14,32.58 90 top
C10  74.58,34.36 90 top
D1  88.3,28.26 90 top
D2  41.44,40.2 180 top
D3  41.44,44.52 180 top
D4  70.01,7.31 180 bottom
D5  93,33.47 180 top
D6  92.87,16.33 180 top
D7  92.36,12.52 180 top
D8  87.3,8.44 270 top
D9  98.73,15.81 270 top
D10  41.44,36.39 180 top
D11  43.47,23.95 90 top
D12  77.12,28.52 0 top
FID1  93,50.8 0 top
FID2  7,13.8 0 top
FID3  10,5.8 0 top
FID4  99.5,43.8 0 top
IC1  72.81,10.99 0 top
IC2  43.72,4.9 270 top
IC3  39.53,6.17 270 bottom
IC4  77.76,42.23 0 top
IC5  10.83,41.22 270 top
IC6  89.32,38.68 90 top
IC7  11.23,22.68 270 top
IC8  51.47,11.5 270 top
IC9  50.84,43.25 0 bottom
IC10  69.12,36.27 180 top
IC11  70.01,46.17 180 top
JP1  72.55,24.96 180 bottom
JP2  92.5,6.15 180 bottom
JP3  41.82,33.85 0 bottom
JP4  72.55,30.8 180 bottom
JP5  72.55,20.14 180 bottom
LED1  39.28,28.05 0 bottom
LED2  39.28,10.55 0 bottom
LED3  39.28,14.05 0 bottom
LED4  39.28,17.55 0 bottom
LED5  39.28,21.05 0 bottom
LED6  39.28,31.42 0 bottom
Q1  28.1,3.88 90 top
Q2  15.15,4.13 90 top
Q3  66.46,16.2 180 top
Q4  93.76,22.17 90 top
Q5  49.18,44.01 90 top
Q6  14.26,31.82 270 top
Q7  79.28,18.48 270 top
R1  8.16,8.83 270 top
R2  22.51,9.72 180 top
R3  R_user  [R0805']  12.87,13.79 180 top
R4  R_user  [R0805']  8.67,9.6 270 bottom
R5  67.73,4.39 270 top
R6  18.96,14.04 180 top
R7  72.3,4.39 90 top
R8  77.89,10.48 270 top
R9  95.03,43.5 90 top
R10  95.03,40.2 90 top
R11  95.03,36.9 90 top
R12  77.89,13.53 270 top
R13  67.47,10.48 90 top
R14  67.47,7.44 90 top
R15  57.31,14.8 0 top
R16  71.28,16.58 270 top
R17  75.35,16.58 90 top
R18  66.21,21.66 180 top
R19  66.2,24.96 90 top
R20  53.5,29.15 180 top
R21  48.8,3.63 0 top
R22  51.34,3.63 0 top
R23  56.68,3.63 180 top
R24  49.25,18.04 270 top
R25  47.85,20.26 270 top
R26  54.52,24.33 0 top
R27  97.95,18.61 90 bottom
R28  88.68,18.87 90 top
R29  97.95,38.49 90 bottom
R30  52.55,20.26 270 top
R31  45.5,12.26 180 top
R32  42.83,13.6 180 top
R33  42.83,18.17 0 top
R34  52.1,37.66 180 top
R35  74.33,22.55 270 top
R36  92.36,19.12 90 bottom
R37  92.36,39 270 bottom
R38  78.78,21.91 90 top
R39  78.78,25.09 90 top
R40  67.22,30.68 270 top
R41  78.14,35.63 270 top
R42  42.83,8.96 0 top
R43  33.31,25.09 270 top
R44  65.57,39.57 0 top
R45  74.58,37.41 270 top
R46  32.8,48.84 90 top
SJ1  72.04,34.11 180 bottom
START  88.81,21.41 0 top
TP1  26.07,7.06 0 top
TP2  17.18,7.69 0 top
TP3  23.21,12.14 0 top
TP4  20.67,17.53 0 top
TP5  23.21,22.93 0 top
TP6  20.67,24.52 0 top
TP7  23.53,30.23 0 top
TP8  20.67,31.5 0 top
TP9  26.07,35.31 0 top
TP10  20.67,37.85 0 top
TP11  26.39,42.3 0 top
TP12  31.47,7.06 0 top
TP13  25.31,45.54 0 top
TP16  31.47,10.55 0 top
TP17  31.47,14.04 0 top
TP18  25.75,17.53 0 top
TP19  36.86,20.07 0 top
TP21  26.07,24.52 0 top
TP22  31.47,28.01 0 top
TP23  31.47,32.14 0 top
TP24  36.55,34.04 0 top
TP25  26.13,37.98 0 top
TP26  25.82,32.58 0 top
U$1  [CE_10.00]  77.63,2.74 0 bottom
X1  72.36,26.3 270 bottom
X2  12.73,8.96 90 bottom
X3  22.58,50.23 180 bottom

### Tracks (layer width: path | path; a pad name or v marks a point on that pad's centre or on a via)
+10V  (via drill 0.6)
  Top 0.406: 74.33,45.15 71.92,47.57 IC11.3 | 74.46,45.03 IC11.16 75.6,43.12 75.09,43.12 75.09,41.22 76.11,40.71 76.26,40.3 IC4.1 | 72.68,39.19 73.69,38.3 R45.2 | 71.16,45.15 71.03,45.15 70.65,44.77 IC11.13 70.65,41.34 71.41,40.71 72.68,39.57 72.68,39.19 | 71.16,45.15 74.33,45.15 | 74.33,45.15 74.46,45.03 | IC10.4 67.22,37.15 68.23,36.14 v68.74,36.14 69.89,36.14 71.03,34.99 IC10.8 | C2.1 76.23,46.81 74.46,45.03 | v73.44,39.06 72.68,39.06 72.68,39.19 | IC11.5 69.38,47.31 | 69.38,47.31 69.38,46.93 71.16,45.15 | 69.38,47.31 72.04,47.31
  Bottom 0.406: v73.44,39.06 73.44,38.3 71.28,36.14 v68.74,36.14
  pour Top: 69.38,47.57 76.87,47.57 76.87,41.6 75.47,41.6 75.47,44.14 75.09,44.52 69.5,44.52 69.5,47.44
+12V  (via drill 0.5, 0.6)  (3 unrouted)
  Top 0.35: 15.8,17.47 15.91,16.96
  Top 0.406: IC5.16 14.01,45.66 v14.01,48.46 | R2.1 22.51,10.61 21.75,11.37 R6.1 v21.24,15.56 17.31,15.56 15.91,16.96 | IC2.3 40.52,3.65 39.79,4.13 IC3.IN | R11.2 97.7,36.9 | R10.2 97.7,40.2 | 79.28,40.71 IC4.3 | R35.1 75.22,23.57 74.33,23.82 | IC6.2 91.86,38.68 91.98,38.55 | R9.2 97.7,43.5 | IC7.9 15.17,18.23 15.8,17.47 | D1.C 88.05,25.47 | 56.3,45.28 56.05,45.28 55.8,45.54 51.39,45.54 Q5.3 | Q4.3 95.94,24.7 95.17,25.47
  Top 0.5: 35.72,30.17 36.86,30.04 41.06,30.04
  Top 0.61: 2.1 TP12.TP 31.09,7.44 | 31.28,30.04 31.53,30.17 | R2.1 v25.69,9.72 | 97.7,41.85 93.25,41.85 92.36,42.36 88.17,42.36 87.16,42.16 80.73,42.16 79.28,40.71 | 74.33,23.82 73.19,24.96
  Top 0.711: 31.28,30.04 28.48,27.63 | 41.06,30.04 41.82,29.41
  Top 0.813: 28.48,27.63 v27.21,27.63 | 31.53,30.17 35.72,30.17 | 41.82,29.41 46.52,29.41 v48.04,29.15 | 71.09,27.5 72.93,27.12 74.46,26.49 | 56.3,45.28 56.27,40.73 57.06,39.46 57.06,30.3 v57.31,29.79 | 73.19,24.96 JP1.2 | 91.98,38.55 97.7,38.55
  Top 1.016: R29.2 97.7,46.68 97.7,43.5 97.7,41.85 97.7,40.2 97.7,38.55 97.7,36.9 97.7,32.07 96.68,31.44 95.79,30.17 95.79,25.47 95.17,25.47 88.05,25.47 86.37,28.26 X1.6 82.94,28.52 81.06,26.74 77.12,26.74 76.11,26.49 74.46,26.49 | 65.69,27.5 71.09,27.5
  Bottom 0.406: IC3.IN 39.28,4.64 | 34.45,6.8 34.48,6.8
  Bottom 0.61: v14.01,48.46 11.85,44.93 11.85,37.28 12.35,36.65 15.53,36.65 19.34,33.85 24.93,29.79 v27.21,27.63 24.16,25.6 24.16,23.95 25.94,21.66 25.94,20.26 25.69,18.23 25.69,16.45 26.83,15.82 26.83,12.9 25.69,11.5 v25.69,9.72 25.82,9.72 28.1,7.44 33.85,7.44 2.1 | 39.28,4.64 36.48,4.64 34.45,6.8 | JP1.2 70.77,26.87 67.47,26.87 65.82,28.26 v65.63,27.57
  Bottom 0.711: 59.03,30.27 64.23,30.27
  Bottom 0.813: v14.01,48.46 X3.1 | 26.45,28.26 26.45,27.38
  Bottom 1.016: v48.04,29.15 55.66,29.15 v57.31,29.79 59.03,30.27 | 64.23,30.27 v65.63,28.71
  Bottom 1.422: v65.63,28.71 v65.63,27.57
+12V1
  Top 0.406: IC1.7 R16.1 R17.1
GND  (via drill 0.6)
  Top 0.406: IC2.2@1 IC2.2
  Top 1.27: 63.79,28.33 58.14,28.33
  Bottom 0.61: X2.1 8.93,7.69 R4.2
  Bottom 1.27: v49.18,27.25 49.56,27.63 57.95,27.63 58.07,27.76 58.33,27.76 58.84,28.14 59.98,28.14
  other vias: 64.68,32.07 28.48,13.91 20.48,35.5 99.53,38.83 42.83,11.5 45.5,26.99 12.59,16.36 6.63,35.25 80.3,6.42 39.28,25.98 51.98,8.96 33.05,2.48 20.36,29.03 70.01,23 79.66,50.23 31.15,25.98 34.33,32.45 57.82,42.61 86.39,39.06 80.43,14.55 28.99,29.79 54.9,35.12 80.43,30.8 77.12,37.03 79.66,43.5 89.59,35.67 86.78,23.57 57.19,6.8 79.23,23.69 69.89,6.42 30.9,22.04 65.19,35.63 34.96,45.15 48.66,50.63
  pour Top (rank 3): 100.3,51.38 5.7,51.38 5.7,8.2 5.5,7.18 14.89,7.18 18.07,6.8 18.07,1.21 100.3,1.21
  pour Bottom: 100.4,51.38 5.7,51.38 5.7,1.21 100.3,1.21
N$1  (via drill 0.6)  (1 unrouted)
  Top 0.61: 94.65,12.77 93.76,14.17 v88.3,14.17 88.68,14.17
  Top 0.813: 94.65,12.77 D7.1 95.16,11.88 95.16,8.58 95.03,8.45 89.84,8.45 | D8.1 87.35,10.68 89.58,8.45 89.84,8.45 | JP2.1 89.96,8.33 89.84,8.45
  Top 1.016: 36.23,34.04 35.1,34.22 35.06,34.22 2.9
  Bottom 0.61: 44.36,28.9 46.77,27.76 47.79,24.58 54.65,24.58 57.31,26.31 63.53,26.31 64.42,25.34 64.81,24.33 65.69,21.66 71.28,21.66 72.04,22.17 75.98,22.17 77,21.79 80.43,21.79 81.19,22.42 86.27,22.42 88.55,20.14 88.55,14.42 v88.3,14.17 | 44.36,31.18 43.47,31.95 41.82,33.6 JP3.2
  Bottom 0.813: 44.36,28.9 44.36,31.18 | 2.9 35.54,35.44 41.76,35.44 41.76,33.91 JP3.2
N$2  (via drill 0.6)
  Top 0.406: v20.04,40.71 19.99,40.46 19.48,39.95 16.68,39.95 16.04,39.3 15.78,38.68 15.28,38.04 IC5.10 | IC6.1 90.53,37.47 90.59,36.9 | 90.59,36.9 R11.1 | 90.59,36.9 90.2,36.77 88.68,36.77 88.3,36.01 83.56,36.01 X1.4
  Bottom 0.406: 64.74,46.12 58.71,46.12 55.41,46.17 34.45,46.17 32.42,44.77 32.29,44.65 29.37,43.06
  Bottom 0.61: X1.4 83.15,36.27 80.2,36.27 67.12,46.12 64.74,46.12 | 29.37,43.06 24.74,40.27 22.51,40.27 v20.04,40.71 19.97,40.65 16.42,40.65 14.77,41.54 14.77,44.77 16.23,48.01 19.4,48.01 20.04,48.65 X3.2
N$3  (via drill 0.6)
  Top 0.406: IC5.13 15.21,41.85 16.86,43.57 v17.18,43.57 | 88.12,39.95 IC6.4 88.05,39.95 88.05,40.71 87.92,40.84 | 85.72,40.92 87.83,40.92 87.92,40.84 | R10.1 93.38,40.2 92.24,41.34 88.43,41.34 87.92,40.84
  Top 0.61: X1.3 85.72,40.92
  Bottom 0.406: 65.76,47.82 63.98,49.85 57.76,49.85 52.3,47.7 26.39,47.7 25.24,46.68 22.51,44.39 21.37,44.39 19.88,43.64 | v17.18,43.57 17.62,43.63 19.21,43.63 19.88,43.64 | 22.26,47.7 20.67,46.11 20.67,44.05 19.88,43.64
  Bottom 0.61: X1.3 82.98,40.39 77.44,40.39 67.98,47.82 65.76,47.82 | X3.3 22.58,48.01 22.26,47.7
N$4  (1 unrouted)
  Top 0.406: 2.7 36.23,29.28 39.53,29.28 40.51,28.05
  Top 0.61: TP22.TP 34.2,28.01 2.7 | 40.51,28.05 LED1.A
  Bottom 0.406: 63.73,22.3 59.09,22.3
  Bottom 0.61: X1.8 80.4,20.36 78.14,17.85 73.28,12.99 68.45,12.99 63.73,22.3 | 59.09,22.3 45.12,22.3 40.8,27.76 40.67,27.88 40.48,27.95
N$5
  Top 0.305: 29.12,5.53 21.78,5.53
  Top 0.406: Q1.3 29.12,5.53 | 21.78,5.53 21.24,6.67 21.24,9.21 20.99,9.47
  Top 0.61: 20.99,9.47 R2.2
N$6  (via drill 0.6)
  Top 0.406: 43.47,26.61 D11.2 44.28,24.78 45.12,23.69 45.12,18.36 v46.01,15.82 47.53,14.04 IC8.2 | Q7.1 75.6,18.48 73.76,18.48 | 73.76,18.48 73.31,18.48 73.06,18.36 71.92,18.36 71.54,18.61 70.65,19.25 | v56.8,11.75 57.58,11.75 58.47,12.77 59.34,14.04 63.41,14.04 64.93,12.77 67.47,12.77 v69,14.8 | R35.2 73.5,21.66 73.76,21.28 73.76,18.48
  Top 0.813: 70.65,19.25 JP5.1
  Bottom 0.406: v46.01,15.82 49.95,15.82 56.17,11.75 v56.8,11.75 | v69,14.8 69,17.34 JP5.1
N$7
  Top 0.406: IC1.2 72.17,6.8 73.19,5.79 R7.2
N$8
  Top 1.27: R27.2 R29.1
N$9  (via drill 0.6)
  Top 0.406: v19.21,6.17 18.2,5.66 Q2.3 | 16.29,15.18 v16.42,14.93 | 17.43,14.29 R6.2
  Top 0.61: v16.42,14.93 17.43,14.29
  Bottom 0.406: v16.42,14.93 16.42,15.06 19.97,13.28 21.5,11.5 21.5,8.96 19.21,6.93 v19.21,6.17
N$10
  Top 1.016: 92.38,28.01 92.38,30.17
N$11  (via drill 0.6)
  Top 0.406: Q4.2 91.98,22.17
  Top 0.61: START.TP v90.2,23.06
  Top 0.813: v90.2,23.06 91.98,22.17 | D5.2 91.22,33.6 89.44,33.72 87.09,33.72 83.47,32.14 X1.5
  Bottom 0.813: X1.5 84.2,32.24 86.9,29.66 86.9,26.11 88.55,24.33 90.08,23.18 v90.2,23.06
N$12  (1 unrouted)
  Top 0.61: TP16.TP 2.2 | 82.97,4.26 91.49,4.26 91.87,3.88 93.9,3.88 96.69,5.66 98.22,5.66 99.54,7.18 99.54,11.25 99.23,11.75 D9.2
  Bottom 0.711: 63.66,6.5 59.47,6.5
  Bottom 0.813: X1.12 83.21,4.51 79.66,4.51 78.78,4.13 65.06,4.13 63.66,6.5 | 59.47,6.5 59.09,6.5 58.2,5.28 46.01,5.28 40.55,8.96 38.64,8.96 LED2.K 2.2
N$13  (1 unrouted)
  Top 0.61: TP17.TP 2.3 | X1.11 85.22,7.72 86.9,6.93 D8.2
  Bottom 0.406: 38.05,15.23 38.52,15.41 42.07,15.41 43.34,17.09
  Bottom 0.61: 38.05,14.04 38.05,15.23 | 43.34,17.09 50.52,17.09 56.68,13.02 57.82,13.02 58.2,12.52 58.2,11.75 59.1,10.47 59.27,10.47
  Bottom 0.711: 59.27,10.47 64.03,10.47
  Bottom 0.813: 2.3 38.05,14.04 | 64.03,10.47 64.44,10.47 66.46,9.85 77,9.85 78.39,8.45 79.56,8.45 X1.11
N$14  (1 unrouted)
  Top 0.61: TP18.TP 28.72,17.53 2.4 | X1.10 82.72,12.44 82.71,12.45 84.44,12.45 84.83,12.52 D7.2
  Bottom 0.406: 42.96,18.1 41.56,16.22 38.39,16.22 38.07,17.53
  Bottom 0.61: 57.19,14.41 51.47,18.1 42.96,18.1
  Bottom 0.711: 64.49,14.41 57.19,14.41
  Bottom 0.813: X1.10 83.2,12.45 78.84,12.45 76.49,10.99 66.9,10.99 64.49,14.41 | 38.07,17.53 30.82,17.55 2.4
N$15
  Top 0.406: Q5.2 48.3,44.01 48.3,43.76
  Top 0.813: IC9.3 48.3,43.76
N$16
  Top 0.406: 50.48,8.96 50.48,7.69 IC8.8 | 50.48,8.96 IC8.6 | 50.48,8.96 50.48,10 51.98,11.5 51.98,16.07 52.99,17.47 53.25,17.47 53.5,17.72 54.77,19.25 54.77,21.41 54.39,21.79 53.63,21.79 52.49,22.55 52.49,26.49 53.5,27.5 R20.1
N$17  (via drill 0.6)
  Top 0.406: IC5.12 15.21,40.58 16.86,42.3 18.45,42.3 21.31,43.88 v21.94,45.47 | R9.1 90.33,43.5 89.82,44.01 86.27,44.01 | IC6.3 91.22,39.63 v91.86,40.2
  Top 0.61: 86.27,44.01 83.47,44.01 X1.2
  Bottom 0.406: 66.46,49.6 65.57,50.59 56.61,50.59 51.6,48.52 25.43,48.52 v21.94,45.47 | v91.86,40.2 89.57,40.2 85.76,44.01 83.47,44.01 X1.2
  Bottom 0.61: X1.2 83.13,44.2 81.06,44.46 78.27,47.82 74.08,47.82 69.12,49.6 66.46,49.6 | X3.4 25.43,50.23 25.43,48.52
N$18
  Top 0.406: IC5.15 12.1,44.39 11.21,43.38 11.21,35.88 10.85,34.89 10.85,23.57 9.71,22.04 IC7.5
N$19
  Top 0.406: 31.61,31.99 31.7,31.18 37.82,31.18 37.82,31.36 LED6.K | 38.01,35.14 39.2,36.03 D10.2
  Top 0.61: LED6.K 38.01,35.14
  Top 1.016: 2.8 TP23.TP 31.61,31.99
  Bottom 0.61: 38.13,45.03 35.91,40.33 34.64,40.33 33.88,39.57 33.5,39.06 30.71,36.2 30.71,32.84 | 29.73,31.82 2.8
  Bottom 0.813: X1.14 57.42,44.12 55.28,45.03 38.13,45.03 | 30.71,32.84 29.73,31.82
N$20  (via drill 0.81)  (1 unrouted)
  Top 0.813: 36.61,37.03 37.5,38.17 41.06,38.17 v41.95,38.8 43.72,40.18
  Top 1.016: 1.9 25.81,35.05 TP9.TP 30.06,35.49 31.79,36.9 35.72,36.9 36.61,37.03
  Bottom 0.813: X1.17 58.37,32.24 57.69,31.95 56.04,31.06 55.03,30.55 47.66,30.55 46.14,32.2 46.14,36.65 v41.95,38.8
N$21  (via drill 0.6)
  Top 0.61: 35.66,43.76 37.31,46.17 42.88,46.17 43.72,45.79 | 43.72,45.79 43.72,42.74 45.82,41.34 45.82,32.45 44.67,31.38 v42.39,30.87 | D3.1 43.72,45.79
  Top 1.016: 35.66,43.76 32.67,43.76 31.09,42.3 TP11.TP 26.07,41.98 24.2,41.98 1.11
  Bottom 0.61: X1.19 58.02,24.32 55.53,23.44 46.07,23.44 42.39,27.76 v42.39,30.87
N$22  (1 unrouted)
  Top 0.406: IC11.11 68.11,44.65 67.6,45.15 66.08,45.15 | 66.08,45.15 65.57,44.65 IC11.9 | 66.08,45.15 66.08,45.41 65.44,46.09 59.09,46.09 | R46.2 34.26,48.84 35.5,47.6 43.2,47.6 44.7,49.1 56,49.1 59.1,46.1
N$23  (via drill 0.6)
  Top 0.406: X1.22 59.34,12.44 57.13,10.03 57.13,8.63 59.09,6.5 64.42,6.5 65.89,5.21 | 65.89,5.21 R5.2 | v64.81,7.94 64.42,6.54 65.89,5.21
  Bottom 0.406: D4.C 67.34,7.31 67.34,7.44 66.84,7.94 v64.81,7.94
N$24  (1 unrouted)
  Top 0.406: 74.71,2.86 69.76,2.86 68.74,4.39 R5.1 | IC1.3 73.44,7.06 74.84,5.66 74.84,4.39 | 74.84,4.39 74.84,2.86 | C1.1 74.84,4.39
N$25
  Top 0.406: IC7.13 15.91,23.31
  Top 0.61: TP6.TP 17.97,24.52 1.6 17.43,24.58 16.8,24.2 15.91,23.31
N$26
  Top 0.406: 1.7 20.73,26.53 16.93,26.49 15.53,24.58 IC7.14
  Top 0.61: TP7.TP 23.53,28.14 1.7
N$27  (via drill 0.6, 0.8)  (3 unrouted)
  Top 0.406: TP26.TP 26.07,32.96 27.59,33.47 | 62.9,18.36 64.42,19.88 64.42,21.66 | 64.42,21.66 64.42,21.91 65.31,23.06 R19.1 | IC7.16 14.28,27.12 | R18.2 64.42,21.66
  Top 0.61: 27.66,33.47 v29.12,33.72 | 14.28,27.12 v14.28,28.77 | v57.31,17.47 58.09,17.47 58.98,18.36 62.9,18.36
  Bottom 0.406: 27.98,34.74 28.86,35.63 31.53,38.42 32.04,39.69 | 38.07,19.44 38.9,18.89 41.56,18.89 41.95,18.99
  Bottom 0.508: 27.98,34.74 27.21,33.6 | 32.29,19.44 38.07,19.44 | 41.95,18.99 51.72,18.99 57.32,17.48
  Bottom 0.61: 32.29,19.44 30.26,20.58 27.09,22.42 26.2,23.31 26.2,25.47 28.74,27.12 28.74,28.64 26.7,29.66 26.07,30.68 26.07,32.45 27.21,33.6 v29.12,33.72 | 2.11 34.23,41.89 32.04,39.69
N$28  (via drill 0.6)
  Top 0.406: v40.55,23.82 39.66,23.44 30.9,23.44 29.78,24.55 2.6 | v57.57,20.64 59.34,22.42 63.41,22.42 64.17,23.18 64.17,26.23 67.73,26.23 68.23,26.3 70.84,26.3 71.35,25.85 71.35,21.66 | JP5.2 72.42,20.14
  Top 0.61: TP21.TP 28.7,24.52 2.6 | 72.42,20.14 71.35,21.66
  Bottom 0.406: v57.57,20.64 56.04,20.64 55.79,20.9 44.36,20.9 v40.55,23.82
N$29
  Top 0.61: JP1.1 R19.2
N$30
  Top 0.406: R22.2 C5.1 55.28,4.51 | IC8.9 55.41,8.83 55.91,8.2 55.91,6.04 55.28,5.4 55.28,4.51 | 55.28,4.51 R23.2
N$31
  Top 0.406: IC8.14 54.65,15.38 54.65,16.58 56.17,18.61 56.17,22.68 55.53,23.44 | R26.2 55.53,23.44 | 55.53,23.44 C6.2
N$32
  Top 0.305: 72.04,32.58 71.54,32.07 68.81,32.07 68.49,32.45
  Top 0.406: IC10.2 69.76,37.53 72.04,35.25 72.04,32.58 72.93,32.58 73.69,32.14 75.43,32.14 77.02,29.96 77.78,29.41 D12.2 79.03,29.24 C9.2 R41.1 79.16,36.39 80.68,37.86 85.51,37.86 85.69,37.73 86.27,37.41 86.65,37.15 86.9,37.28 87.48,37.73 IC6.6 | 68.49,32.45 IC10.6
N$34
  Top 0.61: LED1.K 36.38,26.65 R43.1
N$35
  Top 0.406: R20.2 53.5,33.51 IC9.1
  Top 0.61: R34.1 53.4,36.16 IC9.1
  Bottom 0.711: 58.84,34.21 64.36,34.21
  Bottom 0.762: 68.36,28.44 74.84,28.44
  Bottom 0.813: 58.84,34.21 56.42,33.09 IC9.1 | 67.62,32.18 68.36,28.44
  Bottom 1.016: 64.36,34.21 67.62,32.18 | X1.7 83.12,24.22 80.52,24.22 79.66,25.47 77.89,26.23 74.84,28.44
N$36
  Top 0.406: R26.1 56.04,26.99 56.04,38.93 54.75,41.5 52.18,41.5 51.98,41.7 Q5.1
N$37  (via drill 0.6)
  Top 0.406: IC5.2 9.24,44.39 v10.83,47.57 | IC7.7 10.21,19.5 v10.47,19.75
  Bottom 0.406: 10.83,46.93 9.56,45.28 9.56,34.36 10.01,33.81 10.01,31.65 6.66,31.18 6.66,19.75 v10.47,19.75
  Bottom 0.61: v10.83,47.57 10.83,46.93
N$38
  Top 0.406: 1.3 22.89,14.56 22.89,17.72 21.37,19.25 18.83,19.25 15.55,20.77 IC7.11
  Top 0.61: TP3.TP 23.21,13.82 1.3
N$39
  Top 0.406: 1.5 20.84,21.05 20.74,21.15 18.45,21.15 17.94,21.41 17.05,21.41 15.55,22.04 IC7.12
  Top 0.61: 1.5 23.44,22.7 TP5.TP
N$41
  Top 0.61: LED2.A 40.55,10.23 41.06,9.72 42.64,9.72 R42.1 | LED3.A LED4.A LED5.A
  Bottom 0.508: 36.61,26.87 36.61,28.9
  Bottom 0.61: LED2.A LED3.A | 36.61,26.87 36.61,26.49 38.77,22.8 LED5.A | 36.61,28.9 37.5,30.04 39.04,30.04 LED6.A
N$42
  Top 0.406: X1.16 63.47,36.2 63.53,36.14 66.08,31.95 66.08,31.31 R40.2
N$43
  Top 0.406: R28.2 90.59,20.14 94.14,20.14 Q4.1
N$44  (via drill 0.6)
  Top 0.406: IC7.2 IC7.1 7.8,27.78 7.8,30.05 | 7.8,30.05 7.8,33.06 10.32,36.01 10.32,42.23 9.43,43.12 IC5.3 | Q6.1 12.99,33.47 v12.99,34.23 | v8.59,30.05 7.8,30.05
  Bottom 0.406: v12.99,34.23 10.7,30.05 v8.59,30.05
N$45
  Top 0.406: C7.1 48.62,21.38 R25.1 R30.2
N$46
  Top 0.406: IC8.4 50.71,11.5 51.22,12.26 51.22,16.58 52.74,18.61 53.37,19.37 R30.1 53.12,21.05 C8.1
N$47
  Top 0.406: R33.2 R32.2 43.6,14.17 44.1,13.66 44.1,12.01 R31.1 46.01,10.23 IC8.5
N$48
  Top 0.406: R38.2 79.79,21.91 79.79,19.5 Q7.3
N$49
  Top 0.406: R33.1 43.22,19.12 43.22,21.33 D11.1
N$50  (via drill 0.6)
  Top 0.406: IC7.4 9.52,23.31 9.96,23.95 9.96,30.36 v9.07,32.71
  Top 0.61: v8.29,47.07 8.29,45.66 IC5.1
  Bottom 0.406: v9.07,32.71 8.74,32.71 8.68,32.76
  Bottom 0.61: 8.68,32.76 8.67,32.9 8.67,46.66 v8.29,47.07
N$51
  Top 0.61: R15.1 59.28,16.33 X1.21
N$52
  Top 0.406: 17.89,31.5 1.8 17.05,31.8 Q6.3 | 20.67,31.38 TP8.TP
  Top 0.61: TP8.TP 17.99,31.5 | 17.81,31.5 17.99,31.5 | 17.99,31.5 1.8
N$53  (via drill 0.6)
  Top 0.61: TP25.TP 28.8,38.49
  Top 0.813: v35.59,38.49 28.8,38.49 2.10
  Bottom 0.813: X1.15 41.56,43.06 39.28,43.06 37.5,39.19 36.1,38.49 v35.59,38.49
N$54
  Top 0.813: D6.1 96.68,15.82 96.69,14.68
  Top 1.27: 96.69,14.68 96.69,11.12 R27.1
N$55
  Top 0.61: TP19.TP 36.86,20.16 35.98,21.05 2.5 | X1.9 85.2,16.07 90.02,16.07 D6.2
  Bottom 0.406: LED5.K 39.22,19.73 41.44,19.73 41.82,20.01 | 58.93,18.33 62.17,18.33 63.92,18.36
  Bottom 0.61: 2.5 LED5.K | 41.82,20.01 52.08,20.01 55.28,19.25 57.06,19.25 58.74,18.33 58.93,18.33 | X1.9 83.08,16.33 78.9,16.33 74.33,12.01 67.73,12.01 63.92,18.36
N$56  (1 unrouted)
  Top 0.406: IC5.14 12.73,43.12 12.1,42.49 12.1,35.63 11.74,34.61 11.74,23.06 9.83,20.77 8.05,20.77
N$57  (via drill 0.6)  (1 unrouted)
  Top 0.406: Q1.1 29.12,1.85 18.91,1.85 Q2.1 | 13.62,10.23 X2.2
  Top 0.61: 10.83,10.23 X2.2 13.84,12.1 R3.1 | 10.83,10.23 v10.51,10.29 | 10.83,10.23 8.99,10.23 R1.1 | 14.89,8.71 13.62,10.23 | Q2.1 17.33,3.88 Q2.2 | 14.89,4.13 11.72,4.13 | 14.13,2.36 14.13,4.39 | 13.37,3.88 13.37,5.91
  Top 0.813: 14.89,4.13 14.89,8.71
  Bottom 0.61: X2.2 v10.51,10.29 8.93,10.55 | 8.54,10.67 R4.1
  pour Top: 18.2,6.42 7.02,6.42 7.02,1.34 18.2,1.34
N$58
  Top 0.406: R18.1 67.48,20.39 66.47,19.37 Q3.2 | R15.2 57.96,13.91 58.85,14.8 65.31,14.8 66.46,15.95
  Top 0.61: 66.46,15.95 Q3.2
N$59
  Top 0.406: Q1.2 21.5,3.88 19.97,7.44 17.43,7.44 TP2.TP
  Top 0.61: TP2.TP 17.3,9.72 17.3,10.36 1.2 | 26.07,2.99 24.67,2.99 | 26.07,4.77 24.67,4.77
  pour Top: 28.86,5.15 22.01,5.15 20.74,6.42 20.48,11.75 15.66,11.75 15.4,10.74 15.66,8.71 18.2,6.67 18.2,6.42 18.83,5.91 18.83,2.1 28.86,2.1
N$61  (1 unrouted)
  Top 0.305: 8.18,24.58 6.53,24.58 6.53,28.01 6.91,28.52
  Top 0.406: 6.91,28.52 6.91,33.64 9.48,36.33 9.48,39.31 IC5.6
N$63
  Top 1.422: 65.57,27.63 65.57,28.77
N$64
  Top 0.61: IC9.2 R34.2
N$65
  Top 0.406: R44.2 65.57,37.28 66.33,36.39 67.22,35.32 IC10.5
N$67
  Top 0.406: IC7.10 15.55,19.5 16.18,18.99 17.05,18.44 1.4
  Top 0.61: TP4.TP 17.96,17.53 1.4
N$69
  Top 0.61: TP1.TP 1.1
  Bottom 0.61: 41.25,2.93 35.09,2.93
  Bottom 1.016: X1.1 85.51,48.01 87.41,46.42 87.41,45.85 95.41,40.33 95.41,12.9 90.2,12.9 87.92,11.12 87.92,3.31 87.03,1.72 57.38,1.72 54.26,2.48 44.87,2.48 41.25,2.93 | 35.09,2.93 33.25,4.58 27.57,4.58 1.1
N$83
  Top 0.406: 49.95,4.64 49.95,6.04 IC8.7 | 51.03,4.83 R22.1 51.22,4.64 49.95,4.64 | 49.95,4.64 48.93,4.64 R21.1
N$85
  Top 0.406: Q3.1 69.24,17.36 70.15,16.58 R16.2
N$86
  Top 0.406: R44.1 65.95,40.71 68.49,40.71 | 68.49,40.71 IC10.3 | IC11.12 69.38,41.6 68.49,40.71
N$87
  Top 0.406: R40.1 68.11,28.96 73.44,28.96 74.33,28.64 D12.1
N$88  (via drill 0.6)
  Top 0.406: IC7.15 14.43,25.72 15.31,25.92 16.37,27.19 v16.93,28.26 | R28.1 v86.27,18.61
  Bottom 0.406: v16.93,28.26 19.47,26.49 20.48,26.49 21.24,25.72 21.24,22.93 20.48,22.17 20.48,20.64 24.29,16.83 24.29,16.33 25.82,14.8 25.82,13.41 24.04,11.63 24.04,9.72 28.1,5.66 34.2,5.66 36.23,3.75 40.43,3.75 41.07,4.26 56.82,4.26 58.47,2.99 58.45,2.99 58.84,2.74 86.01,2.74 86.78,3.88 86.78,17.6 v86.27,18.61
N$89
  Top 0.406: IC11.14 71.92,41.6 74.58,39.95 74.58,38.55 R45.1 | 75.47,37.15 R45.1 | C10.1 73.69,35.12 75.47,36.52 R45.1
N$90  (via drill 0.5)
  Top 0.254: R46.1 32.67,46.81 v32.8,46.68 32.93,46.81 33.69,48.84
  Top 0.406: TP13.TP 28.73,45.54 2.12 28.99,45.81 28.99,46.93 30.9,48.84 R46.1
N$92
  Top 0.406: IC1.1 70.9,9.85 71.54,10.48 R8.2
N$93  (via drill 0.6)
  Top 0.813: D3.2 40.25,42.36 D2.2 39.28,40.2 v40.42,41.73
  Top 1.016: 1.10 TP10.TP 23.02,37.92 24.54,39.43 27.4,40.39 31.15,40.39 31.47,40.07 37.25,40.07 37.75,42.36
  Top 1.93: 37.75,42.36 40.25,42.36
  Bottom 0.61: 68.73,34.11 68.73,33.84 | SJ1.1 70.01,34.11 69.24,33.33
  Bottom 0.711: 59.22,38.17 64.55,38.17
  Bottom 0.813: v40.42,41.73 41.82,41.73 59.22,38.17 | 64.55,38.17 68.36,34.21 68.73,33.84 69.24,33.33 70.01,32.56 JP4.1
N$94
  Bottom 0.61: 74.49,33.72 73.6,34.11 SJ1.2
  Bottom 0.813: 92.36,28.9 R36.2 | 92.36,28.9 R37.2 | JP4.2 72.55,31.82 74.49,33.72 74.97,34.23 86.39,34.23 91.6,28.9 92.36,28.9
N$95  (via drill 0.6)
  Top 0.813: D9.1 98.73,20.39 v99.23,20.9
  Bottom 0.813: v99.23,20.9 99.23,20.64 99.49,20.39 99.49,11.5 99.74,11.25 99.74,7.94 96.44,4.64 94.02,4.64 JP2.2
N$96
  Top 0.406: C3.1 R8.1 R12.1
N$97
  Top 0.406: IC1.5 74.9,13.59 75.73,14.42 | 75.73,14.42 76.36,15.06 76.36,16.96 R17.2 | R12.2 76.87,13.28 75.73,14.42
N$98
  Top 0.406: 43.22,36.12 43.68,36.12 D10.1
  Top 0.61: JP3.1 44.36,35.71 D10.1
N$99
  Top 0.406: 76.62,21.91 76.23,21.03 | R38.1 76.62,21.91 | 76.62,21.91 76.62,24.58 77,25.09 R39.1
  Top 0.813: 76.23,21.03 JP5.3
N$101
  Top 0.406: R13.1 66.58,10.1 68.23,8.45 68.23,7.82 R14.2 68.36,8.45 69.76,9.47 69.76,10.74 70.52,11.5 72.81,11.5 73.31,12.01 73.31,13.46 IC1.6
N$580  (1 unrouted)
  Top 0.406: IC8.1 48.68,16.45 48.3,17.53 R24.2 48.3,18.87 47.53,19.25 47.28,19.37 R25.2
VCC  (via drill 0.6)
  Top 0.406: R24.1 50.26,17.53 50.43,16.45 50.43,12.77 IC8.3 46.64,12.77 46.14,13.28 46.07,13.28 R31.2 | R21.2 47.41,3.63 47.41,6.29 46.27,7.43 46.27,7.56 | IC2.1 41.47,7.03 40.93,7.44 | R13.2 68.36,11.88 | 68.36,11.88 70.01,13.53 70.84,13.53 IC1.8 | 68.36,11.88 65.57,11.88 64.17,10.48 58.84,10.48 v58.07,9.21 | 6V.TP 37.63,8.58 38.71,7.5
  Top 0.61: v45.12,14.42 R31.2 | 40.93,8.2 42.83,8.2 | 42.83,8.2 44.36,8.2 | C4.1 38.71,7.5 38.77,7.44 | R42.2 42.83,8.2
  Top 0.813: 40.93,8.2 40.93,7.44 IC3.OUT 38.77,7.44 | 44.36,8.2 45.63,8.2 | 45.63,8.2 v45.5,8.33 | 46.27,7.56 45.63,8.2
  Bottom 0.406: v58.07,9.21 55.91,9.21 54.26,7.94 53.88,7.56 47.15,7.56 46.39,8.33 v45.5,8.33
  Bottom 0.61: v45.5,8.33 45.5,13.91 v45.12,14.42

### Text on the board
Top: top
Bottom: BEP V3.2 / maru-labs.com
tPlace: 4 | 2 | 3 | 1 | b | c | 5 | a | 5 | 4 | 3 | 1 | 2
bPlace: QC
tNames: 78L10 | N | BSS138 | N | BSS138 | GND / / <> / / N / / G4 / / G2 / / CC | < / / > / / G5 / / G3 / / G1 / / / BAT
bNames: GND c b a 12V | GND / BT / HiB | BL <> / Resistor | RPM | RPM / SPD / HiB | WRN | 18 | enable / Bulb Test / on WRN / ON / OFF | 2.7 / 2.6 | 19 | 1.12 GND / 1.11< / 1.10<> / 1.9 > / 1 8 N / 1.7 G5 / 1.6 4 / 1.5 G3 / 1.4 G2 / 1.3 G1 | enable / Choke / on WRN | 1.2 CC | 1 BAT / 2 GC / 3 GB / 4 GA / / / 7 RES / 8 ABS / 9 ALT / 10 TMP / OIL | ALT / TMP / OIL / CHK / SWP | 1.1 BAT | OFF/ ON | 2.12 / 2.11 / 2.10 / / / / / 2.5 / 2.4 / 2.3 / 2.2 / 2.1 | CHK | 13 / 14 / 15 / 16 / 17 / / / / 21 SPDin / 22 SPDout / 23 / 24
tValues: M7 | M7 | SS12 | M7 | M7 | M7 | SS12 | 2.4/1.1V | 6,8 | M7 | 4 | SS12 | 13 GND / 14 BT / 15 HiB / 16RPM / 17 > / 18 GND / 19 < / / 21SPD in / 22SPD out / 23 GND | RPM / / HiB / / BT / / BAR / / TMP / / CHK | SPD / / WRN / / ABS / / ALT / / OIL / / SWP | 6V | SS12 | BA | 1 BAT / 2 GC / 3 GB / 4 GA / 5 START / 6SWP / 7RES / 8 ABS / 9ALT / 10 TMP / 11OIL / 12CHK | BA | 4.7V
bValues: 2.2 kOhm / SPD / Pull-up / (Middle / Switch ) | OFF ON | BT | > | ABS | OFF/ ON | BAR/RES | > | BAR/RES | Mode / Selector
bStop: BEP V3.2 / maru-labs.com